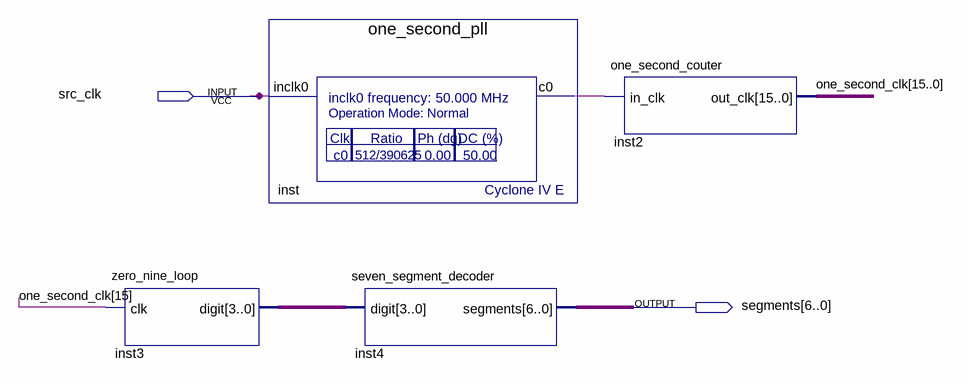
[diagram p0: schematic sheet]
// Quartus schematic zero_nine_loop_counter.bdf as structural Verilog: 4 symbols, 2 pins
module zero_nine_loop_counter (
  input  src_clk,
  output [6:0] segments
);

  wire inst_c0;
  wire [3:0] inst3_digit;
  wire [15:0] one_second_clk;

  zero_nine_loop inst3 (.clk(one_second_clk[15]), .digit(inst3_digit));
  one_second_pll inst (.inclk0(src_clk), .c0(inst_c0));
  seven_segment_decoder inst4 (.digit(inst3_digit), .segments(segments));
  one_second_couter inst2 (.in_clk(inst_c0), .out_clk(one_second_clk));
endmodule
